# EAGLE design cherrykeys_v4 (EAGLE 8.1.0)
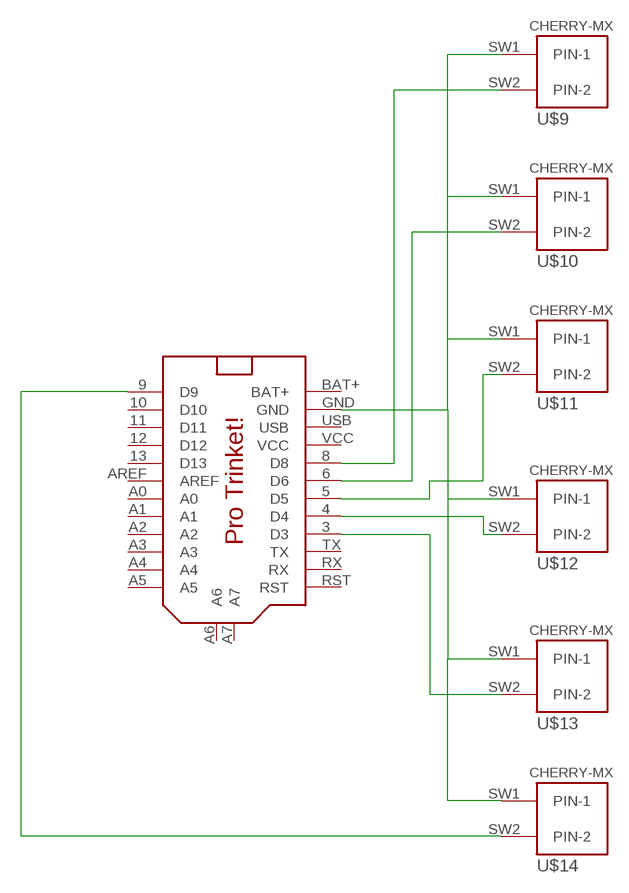
[diagram p0: schematic, sheet 1]

## Parts
U$7  PRO_TRINKET  [PROTRINKET]
U$9  CHERRY-MX  [CHERRY-MX]
U$10  CHERRY-MX  [CHERRY-MX]
U$11  CHERRY-MX  [CHERRY-MX]
U$12  CHERRY-MX  [CHERRY-MX]
U$13  CHERRY-MX  [CHERRY-MX]
U$14  CHERRY-MX  [CHERRY-MX]

## Nets
GND: U$7.GND U$9.SW1(PIN-1) U$10.SW1(PIN-1) U$11.SW1(PIN-1) U$12.SW1(PIN-1) U$13.SW1(PIN-1) U$14.SW1(PIN-1)
N$2: U$7.3(D3) U$13.SW2(PIN-2)
N$3: U$7.4(D4) U$12.SW2(PIN-2)
N$4: U$7.5(D5) U$11.SW2(PIN-2)
N$5: U$7.6(D6) U$10.SW2(PIN-2)
N$6: U$7.8(D8) U$9.SW2(PIN-2)
N$8: U$7.9(D9) U$14.SW2(PIN-2)
Unconnected: U$7.10(D10) U$7.11(D11) U$7.12(D12) U$7.13(D13) U$7.A0 U$7.A1 U$7.A2 U$7.A3 U$7.A4 U$7.A5 U$7.A6 U$7.A7 U$7.AREF U$7.RST U$7.RX U$7.TX

## Power pins joined to a net without a drawn wire
BAT+: U$7.BAT+
USB: U$7.USB
VCC: U$7.VCC

## Library data of the parts
U$7 = adafruit:PRO_TRINKET
U$9-U$14 = cherrymx:CHERRY-MX: Cherry MX series keyswitch

## Board
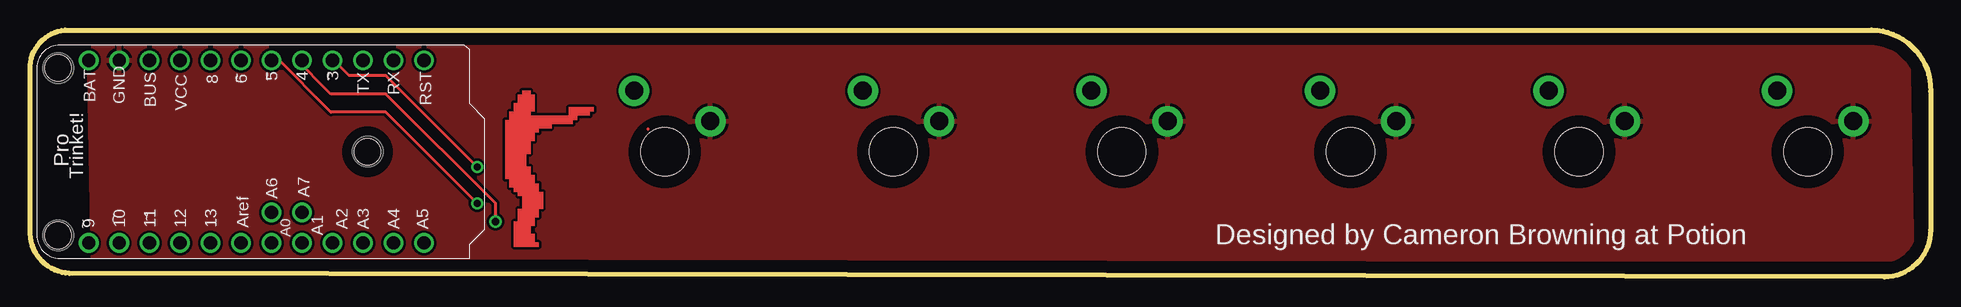
[diagram p1: board, top side]
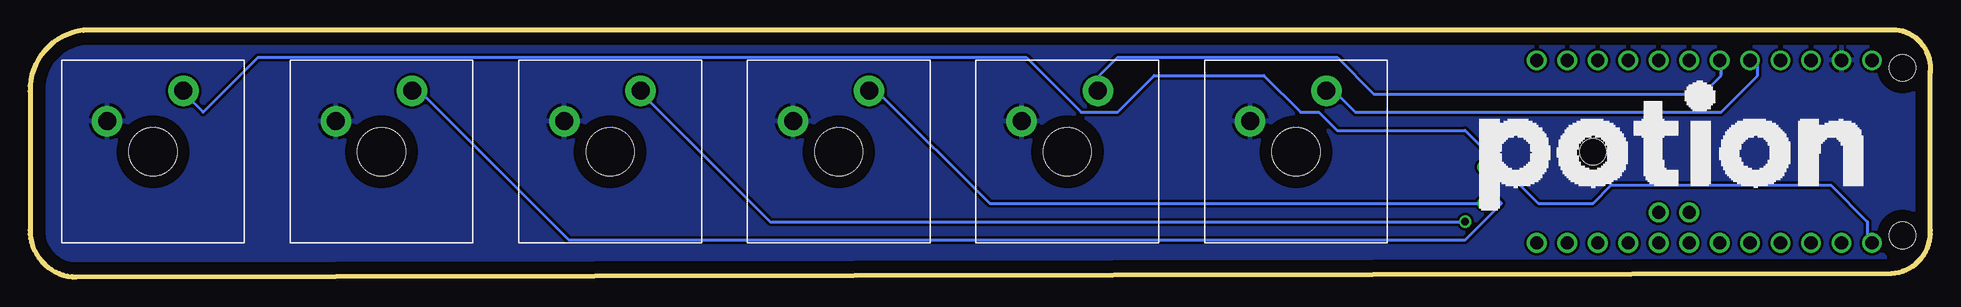
[diagram p2: board, bottom side, seen from below]

Size 158.39 x 20.62 mm. Coordinates in mm from the lower left corner, seen from the top.
Outline: 158.39,15.51 158.39,3.92 arc-90 154.53,0 3.28,0.3 arc-90 0.02,3.9 0.02,17.06 arc-90 2.9,20.62 153.48,20.62 arc-90 158.39,15.51
Copper layers (1*16): Top 0.035mm / dielectric 1.5mm / Bottom 0.035mm
Design rules "default": minimum track width 10mil, minimum drill 24mil, track to track 8mil, track to pad 8mil, pad to pad 8mil, via to via 8mil, smd to smd 8mil, copper to edge 40mil, drill to drill 8mil, minimum pad ring 10mil, minimum via ring 8mil, stop-mask expansion 4mil, vias tented up to drill 0mil, thermal gap 10mil

### Footprints (pad centres in the part's own frame; a part is rotated, then mirrored left to right if it is on the bottom)
PROTRINKET = drill 1.1: 3 7.62,2.921; 4 7.62,5.461; 5 7.62,8.001; 6 7.62,10.541; 8 7.62,13.081; 9 -7.62,23.241; 10 -7.62,20.701; 11 -7.62,18.161; 12 -7.62,15.621; 13 -7.62,13.081; A0 -7.62,8.001; A1 -7.62,5.461; A2 -7.62,2.921; A3 -7.62,0.381; A4 -7.62,-2.159; A5 -7.62,-4.699; A6 -5.08,8.001; A7 -5.08,5.461; AREF -7.62,10.541; BAT+ 7.62,23.241; GND 7.62,20.701; RST 7.62,-4.699; RX 7.62,-2.159; TX 7.62,0.381; USB 7.62,18.161; VCC 7.62,15.621 | hole 2.2: -6.985,25.781; 6.985,25.781; 0,0
CHERRY-MX = drill 1.5 pad 2.54: SW1 -3.81,2.54; SW2 2.54,5.08 | hole 4: 0,0

### Placement (x,y rotation side)
U$7  28.13,10.46 90 top
U$9  52.89,10.46 0 bottom
U$10  71.94,10.46 0 bottom
U$11  90.99,10.46 0 bottom
U$12  110.04,10.46 0 bottom
U$13  129.09,10.46 0 bottom
U$14  148.14,10.46 0 bottom

### Tracks (layer width: path | path; a pad name or v marks a point on that pad's centre or on a via)
GND
  pour Bottom: 0.53,20.37 0.53,20.2 0.53,0.56 156.86,0.56 156.86,20.37
  pour Top: 4.89,19.18 5.22,1.57 156.87,1.47 156.53,19.25 4.89,19.35
N$2  (via drill 0.61)
  Top 0.254: v37.27,9.19 29.65,16.81 26.6,16.81 25.08,18.33 U$7.3
  Bottom 0.254: v37.27,9.19 37.27,7.67 35.75,6.14 38.79,3.09 113.47,3.09 125.66,15.29 U$13.SW2
N$3  (via drill 0.61)
  Top 0.254: v38.79,4.62 38.79,6.14 29.65,15.29 25.08,15.29 22.03,18.33 U$7.4
  Bottom 0.254: v38.79,4.62 96.71,4.62 107.37,15.29 U$12.SW2
N$4  (via drill 0.61)
  Top 0.254: v37.27,6.14 29.65,13.76 25.08,13.76 20.51,18.33 U$7.5
  Bottom 0.254: v37.27,6.14 78.42,6.14 87.56,15.29 U$11.SW2
N$5
  Bottom 0.254: U$7.6 17.46,18.33 17.46,16.81 18.98,15.29 46.41,15.29 49.46,18.33 67.75,18.33 69.27,16.81 69.27,15.29 U$10.SW2
N$6
  Bottom 0.254: U$7.8 14.41,18.33 14.41,16.81 17.46,13.76 47.94,13.76 49.46,15.29 U$9.SW2
N$7
  Top 0.254: 51.52,12.31 51.52,12.39
N$8
  Bottom 0.254: U$7.9 5.27,3.09 5.27,4.62 8.31,7.67 26.6,7.67 28.13,6.14 32.7,6.14 38.79,12.24 49.46,12.24 50.99,13.76 52.51,13.76 55.56,16.81 64.7,16.81 67.75,13.76 70.8,13.76 75.37,18.33 139.38,18.33 143.95,13.76 145.47,15.29 U$14.SW2
(copper drawn outside any net)
  shapes: Top area x39

### Text on the board
tPlace: Designed by Cameron Browning at Potion